# EasyEDA Pro project 16P1D_EDA.eprj

# Schematic ESP_MCB_SCH

## Sheets
1 ESP32: Board Name: ESP_MCB; Create Date: 2025-03-12; Page Name: ESP32; Project Name: 16P1D_EDA; Schematic Name: ESP_MCB_SCH; Update Date: 2025-03-13; Company: 嘉立创EDA; Page Size: A4; Version: V1.0
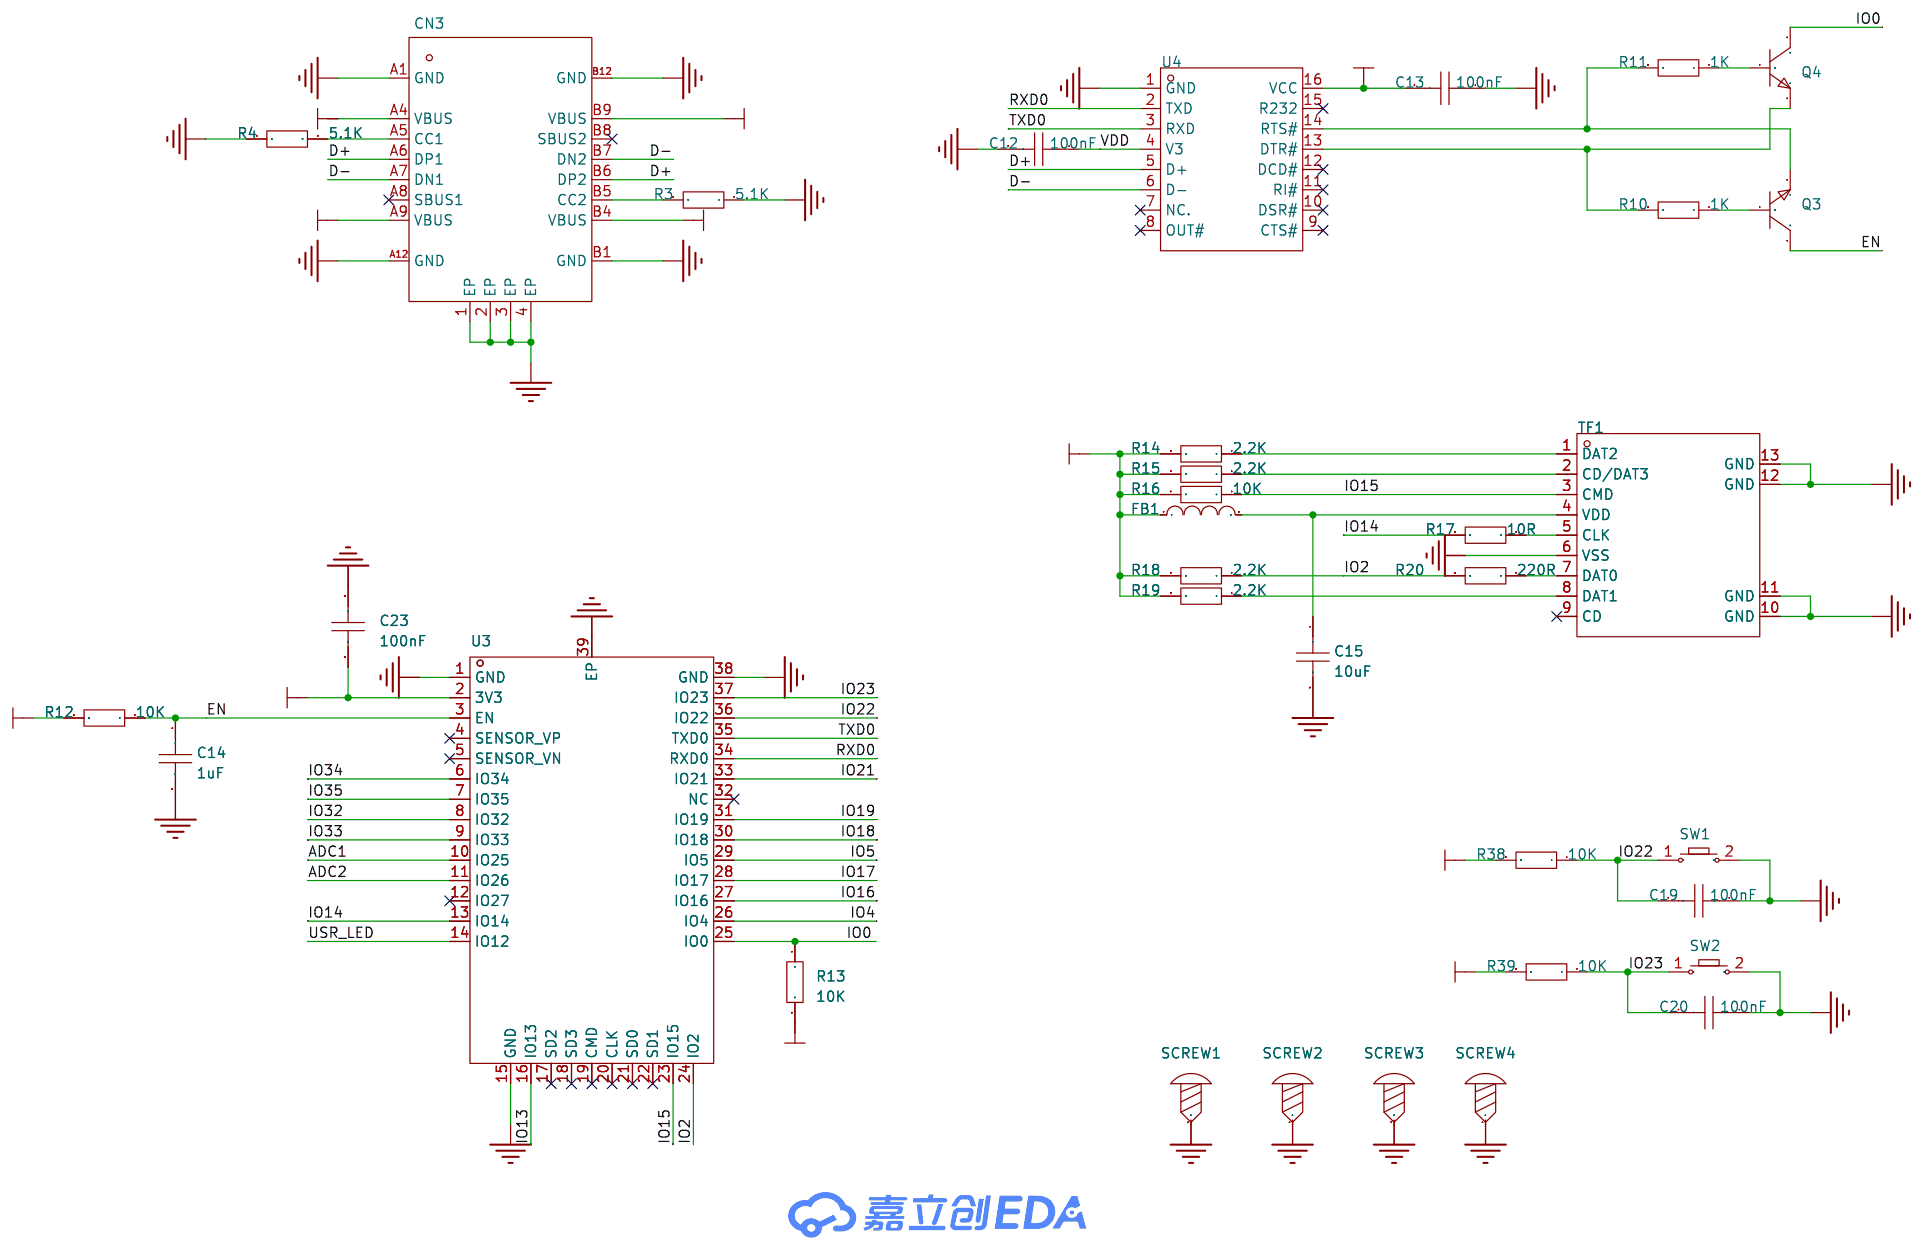
[diagram p0: ESP32]
2 DC: Page Name: DC
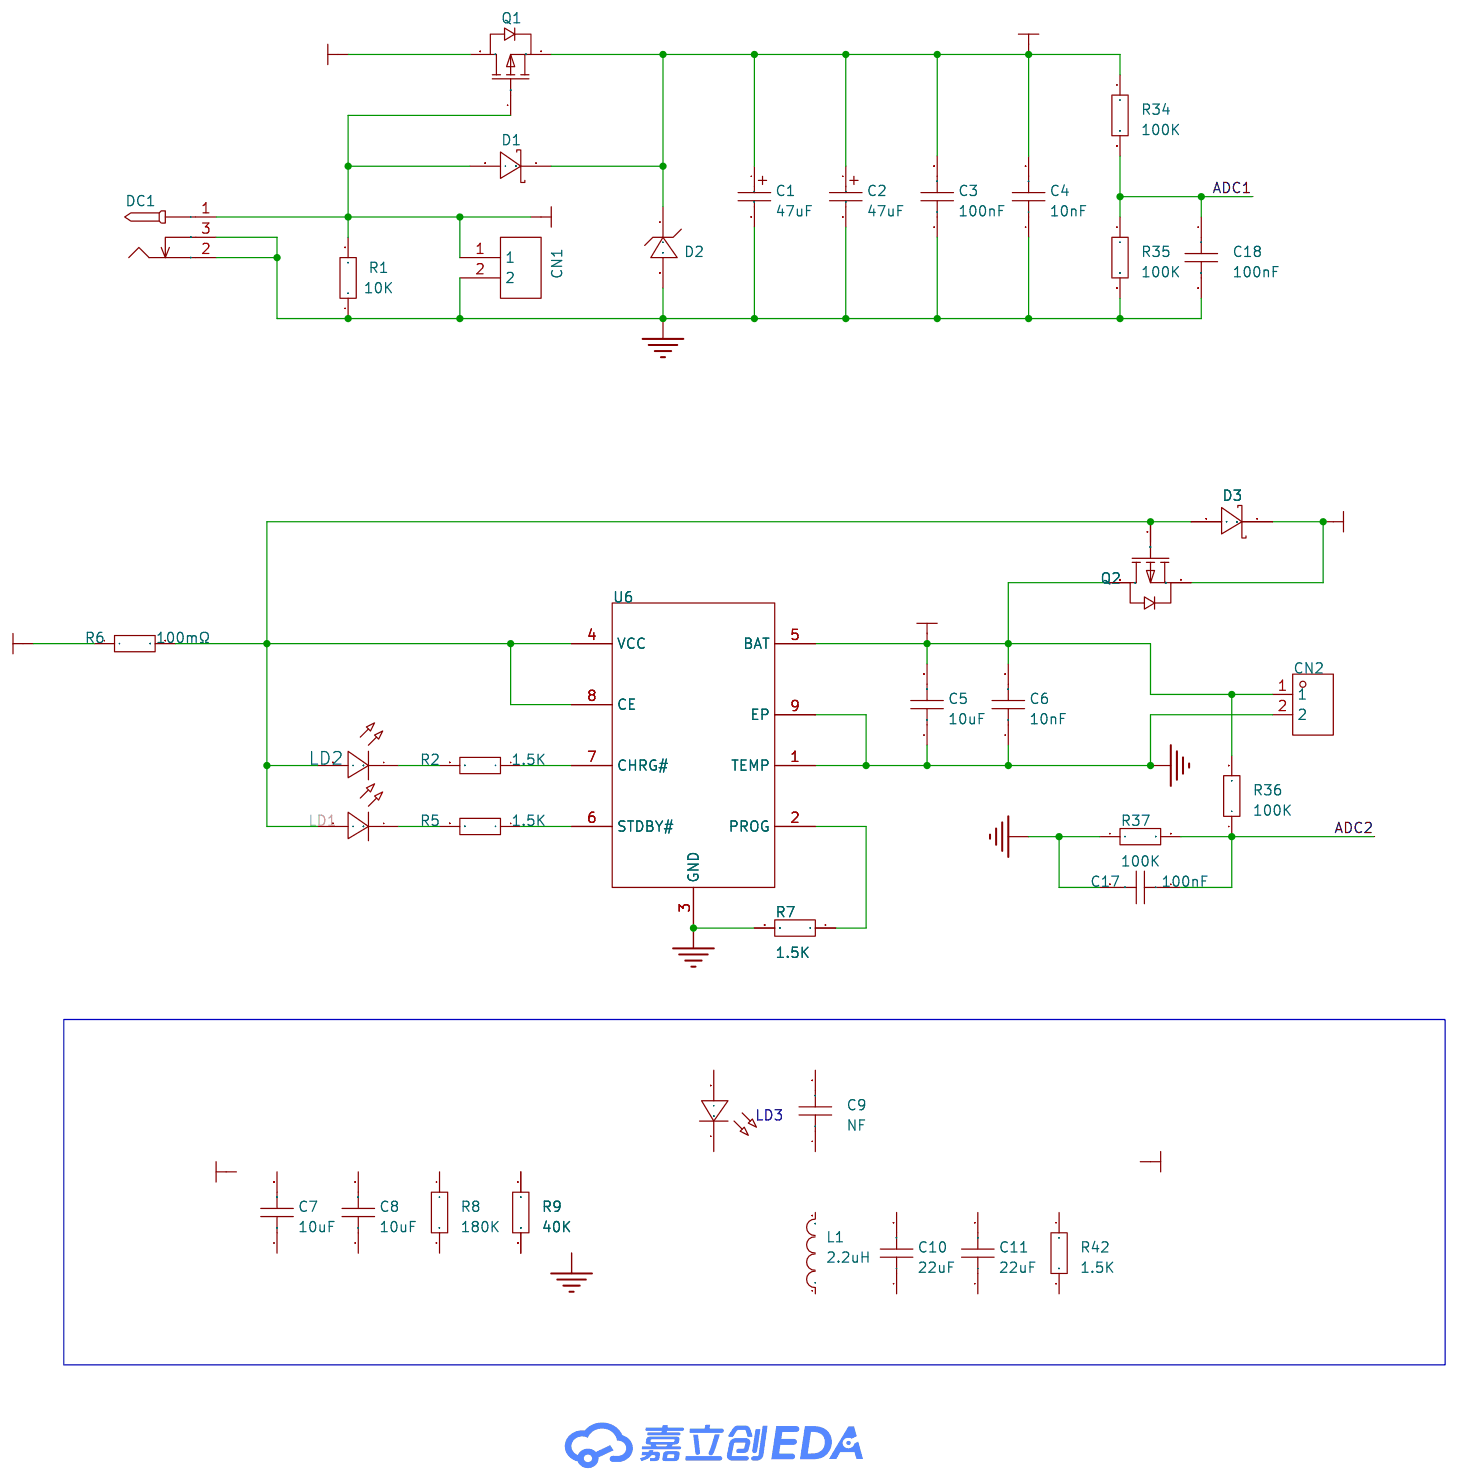
[diagram p1: DC]
3 RELAY: Page Name: RELAY
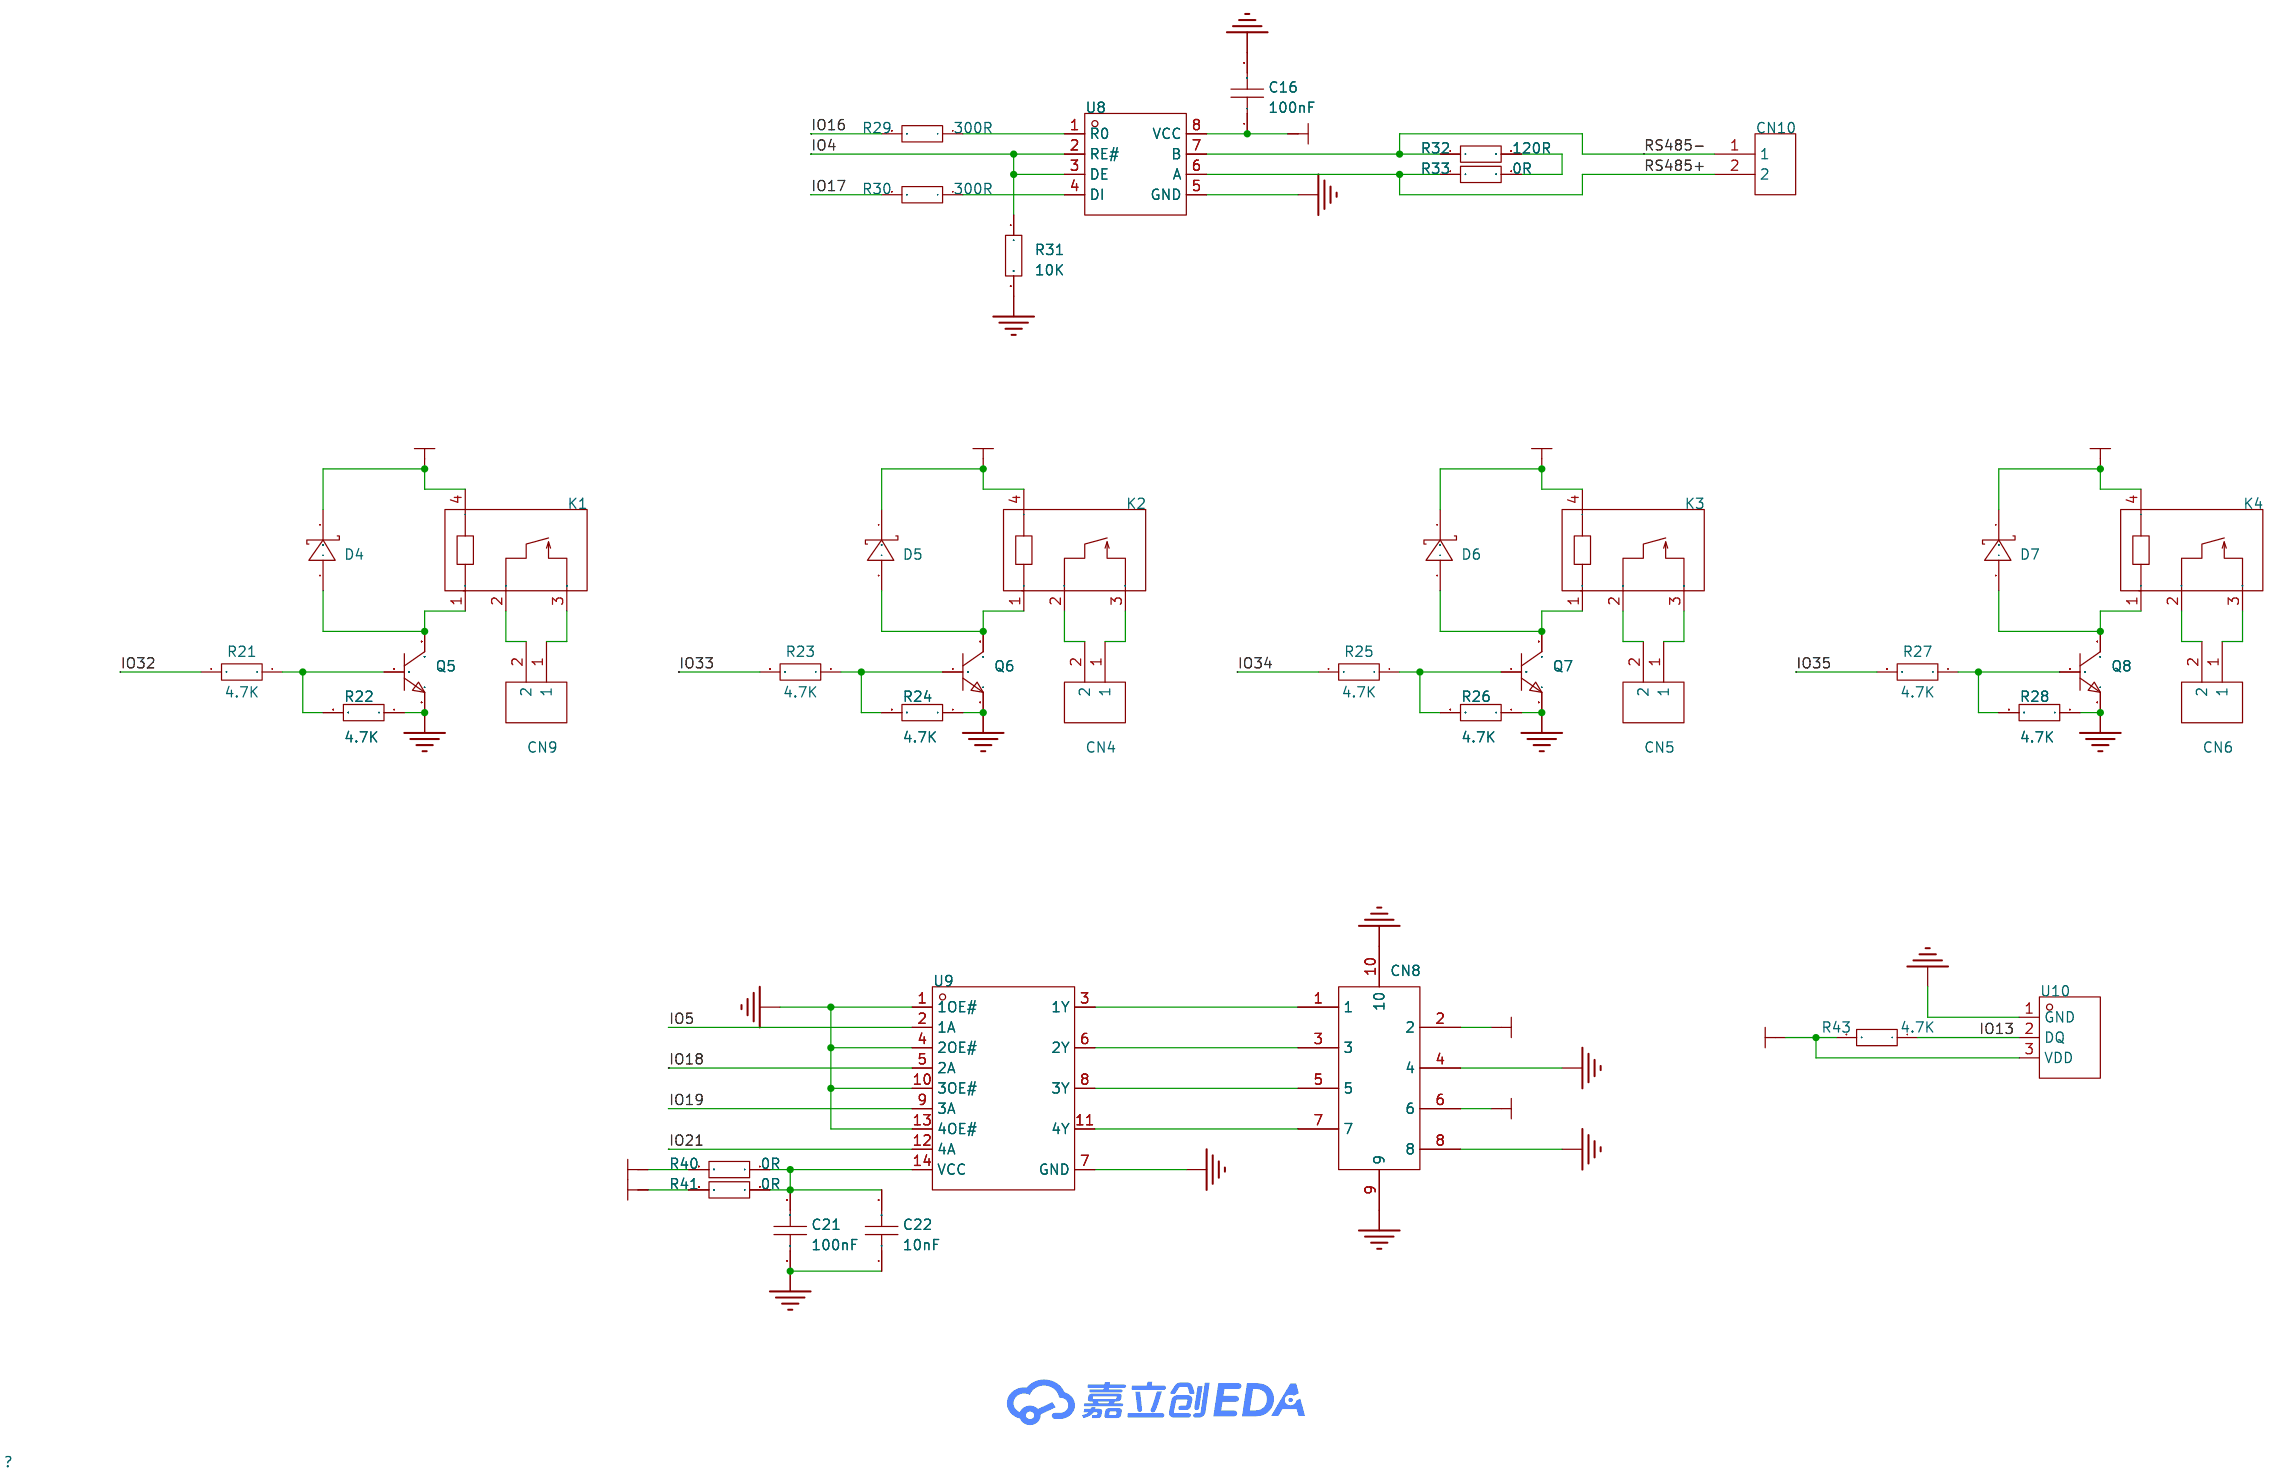
[diagram p2: RELAY]

## Parts
sheet DC
C1  47uF  [C_Ele_SMD_5x5.4mm]
C2  47uF  [C_Ele_SMD_5x5.4mm]
C3  100nF  [C0805]
C4  10nF  [C0805]
C5  10uF  [C0805]
C6  10nF  [C0805]
C7  10uF  [C0805]
C8  10uF  [C0805]
C9  NF  [C0805]
C10  22uF  [C0805]
C11  22uF  [C0805]
C17  100nF  [C0805]
C18  100nF  [C0805]
CN1  WJ500V-5.08-2P  [CONN-TH_2P-P5.00_WJ500V-5.08-2P]
CN2  ZX-XH2.54-2PZZ  [CONN-TH_2P-P2.50_HX25003-2A]
D1  SS34  [SMC_L6.9-W5.9-LS7.9-RD]
D2  SMBJ6.0A  [SMB_L4.6-W3.6-LS5.3-RD]
D3  SS34  [SMC_L6.9-W5.9-LS7.9-RD]
DC1  -  [DC-005_2.5]
L1  2.2uH  [IND-SMD_L4.4-W4.2]
LD1  -  [LED_0805]
LD2  -  [LED_0805]
LD3  -  [LED_0805]
Q1  AO3401A  [SOT-23_L2.9-W1.3-P1.90-LS2.4-BR]
Q2  AO3401A  [SOT-23_L2.9-W1.3-P1.90-LS2.4-BR]
R1  10K  [R0805]
R2  1.5K  [R0805]
R5  1.5K  [R0805]
R6  100mΩ  [R1210]
R7  1.5K  [R0805]
R8  180K  [R0805]
R9  40K  [R0805]
R34  100K  [R0805]
R35  100K  [R0805]
R36  100K  [R0805]
R37  100K  [R0805]
R42  1.5K  [R0805]
U6  TP4056-42-ESOP8  [ESOP-8_L4.9-W3.9-P1.27-LS6.0-BL-EP]
sheet ESP32
C12  100nF  [C0805]
C13  100nF  [C0805]
C14  1uF  [C0805]
C15  10uF  [C0805]
C19  100nF  [C0805]
C20  100nF  [C0805]
C23  100nF  [C0805]
CN3  -  [USB_TYPE-C-16P]
FB1  10uH  [L0805]
Q3  SS8050  [SOT-23-3_L2.9-W1.3-P1.90-LS2.4-BR]
Q4  SS8050  [SOT-23-3_L2.9-W1.3-P1.90-LS2.4-BR]
R3  5.1K  [R0805]
R4  5.1K  [R0805]
R10  1K  [R0805]
R11  1K  [R0805]
R12  10K  [R0805]
R13  10K  [R0805]
R14  2.2K  [R0805]
R15  2.2K  [R0805]
R16  10K  [R0805]
R17  10R  [R0805]
R18  2.2K  [R0805]
R19  2.2K  [R0805]
R20  220R  [R0805]
R38  10K  [R0805]
R39  10K  [R0805]
SCREW1  -  [M2螺丝]
SCREW2  -  [M2螺丝]
SCREW3  -  [M2螺丝]
SCREW4  -  [M2螺丝]
SW1  -  [Key_SMD_3x4x2]
SW2  -  [Key_SMD_3x4x2]
TF1  TF-CARD H1.8  [TF-SMD_TF-CARD-H1.8]
U3  ESP32-WROOM-32  [WIFIM-SMD_ESP-WROOM-32]
U4  CH340C  [SOP-16_L10.0-W3.9-P1.27-LS6.0-BL]
sheet RELAY
C16  100nF  [C0805]
C21  100nF  [C0805]
C22  10nF  [C0805]
CN4  WJ500V-5.08-2P  [CONN-TH_2P-P5.00_WJ500V-5.08-2P]
CN5  WJ500V-5.08-2P  [CONN-TH_2P-P5.00_WJ500V-5.08-2P]
CN6  WJ500V-5.08-2P  [CONN-TH_2P-P5.00_WJ500V-5.08-2P]
CN8  8P-立贴带锁  [FPC-SMD_8P-P0.50_AFC11-S08ICC-00]
CN9  WJ500V-5.08-2P  [CONN-TH_2P-P5.00_WJ500V-5.08-2P]
CN10  WJ500V-5.08-2P  [CONN-TH_2P-P5.00_WJ500V-5.08-2P]
D4  SS34  [SMC_L6.9-W5.9-LS7.9-RD]
D5  SS34  [SMC_L6.9-W5.9-LS7.9-RD]
D6  SS34  [SMC_L6.9-W5.9-LS7.9-RD]
D7  SS34  [SMC_L6.9-W5.9-LS7.9-RD]
K1  G5NB-1A-E-12VDC  [RELAY-TH_G5NB-1A-E-DCXX]
K2  G5NB-1A-E-12VDC  [RELAY-TH_G5NB-1A-E-DCXX]
K3  G5NB-1A-E-12VDC  [RELAY-TH_G5NB-1A-E-DCXX]
K4  G5NB-1A-E-12VDC  [RELAY-TH_G5NB-1A-E-DCXX]
Q5  SS8050  [SOT-23-3_L2.9-W1.3-P1.90-LS2.4-BR]
Q6  SS8050  [SOT-23-3_L2.9-W1.3-P1.90-LS2.4-BR]
Q7  SS8050  [SOT-23-3_L2.9-W1.3-P1.90-LS2.4-BR]
Q8  SS8050  [SOT-23-3_L2.9-W1.3-P1.90-LS2.4-BR]
R21  4.7K  [R0805]
R22  4.7K  [R0805]
R23  4.7K  [R0805]
R24  4.7K  [R0805]
R25  4.7K  [R0805]
R26  4.7K  [R0805]
R27  4.7K  [R0805]
R28  4.7K  [R0805]
R29  300R  [R0805]
R30  300R  [R0805]
R31  10K  [R0805]
R32  120R  [R0805]
R33  0R  [R0805]
R40  0R  [R0805]
R41  0R  [R0805]
R43  4.7K  [R0805]
U8  MAX485EIM/TR  [SOP-8_L4.9-W3.9-P1.27-LS6.0-BL]
U9  74HC125D/S400118  [SOIC-14_L8.6-W3.8-P1.27-LS6.0-BL]
U10  GX18B20  [TO-92-3_L4.9-W3.7-P1.27-L]

## Library data of the parts
C1 C2 = C_Ele_SMD_5x5.4mm: Supplier Footprint: SMD,5x5.4mm
C3-C23 = CAP_0805: Supplier Footprint: 0805
CN1 CN4-CN6 CN9 CN10 = WJ500V-5.08-2P: 结构:1x2P;间距:5.08mm;颜色:绿色;安装方式:直插;额定电流:18A;额定电压:250V;排数:1;线规 - AWG:14~30;线规 - 平方毫米:2.5;每排PIN数:2;触头材质:-;触头镀层:-;工作温度范围:-40℃~+105℃;焊接温度(最大值):-;; LCSC Part Name: 1x2P 5.08mm 直插 排数:1 每排P数:2; Supplier Part: C8465; Manufacturer: KANGNEX(康奈克斯电气); Supplier Footprint: 插件,P=5.08mm; JLCPCB Part Class: 扩展库; Datasheet: https://atta.szlcsc.com/upload/public/pdf/source/20191225/C8465_02D34CE5B5B4A53DF5891601D97FA9F4.pdf; Supplier: LCSC; Structure: 1x2P; Pitch: 5.08mm; Color: 绿色; Mounting Style: 直插; Current Rating (Max): 18A; Voltage Rating (Max): 250V; Number of Pins: 2P; Number of Rows: 1; Wire Gauge - AWG: 14~30; Wire Gauge - mm2: 2.5; Number of PINs Per Row: 2; Operating Temperature Range: -40℃~+105℃; Screw Specification: M2.5
CN2 = ZX-XH2.54-2PZZ: 插针结构:1x2P;间距:2.5mm;安装方式:直插;参考系列:XH;总PIN数:2P;排数:1;每排PIN数:2;行距:-;额定电流:3A;触头材质:黄铜;触头镀层:锡;工作温度范围:-25℃~+85℃;; LCSC Part Name: 1x2P 间距:2.5mm 直插 系列:XH; Supplier Part: C7429632; Manufacturer: Megastar(兆星); Supplier Footprint: 插件,P=2.5mm; JLCPCB Part Class: 扩展库; Datasheet: https://atta.szlcsc.com/upload/public/pdf/source/20230619/19BA6947230AA44A04D3EDD65E618FD0.pdf; Supplier: LCSC; Pins Structure: 1x2P; Pitch: 2.5mm; Mounting Type: 直插; Reference Series: XH; Number of Pins: 2P; Number of Rows: 1; Number of PINs Per Row: 2; Rated Current: 3A; Contact Material: 黄铜; Contact Plating: 锡; Operating Temperature: -25℃~+85℃; Rated Voltage (Max): 250V; Plastic Material: PA66; Flame Retardant Rating: UL94V-0; Color: 白色; Z-Height of the Board: 7mm; X-Length of Bottom Edge on Board (Spacing Line): 7.5mm; Y-Width of Bottom Edge on Board: 5.9mm
D1 D3-D7 = SS34_C154551: 正向压降(Vf):500mV@3A;直流反向耐压(Vr):40V;整流电流:3A;; LCSC Part Name: 电压:40V 电流:3A; Supplier Part: C154551; Manufacturer: onsemi(安森美); Supplier Footprint: SMC(DO-214AB); JLCPCB Part Class: 扩展库; Datasheet: https://atta.szlcsc.com/upload/public/pdf/source/20230523/C977B907190B075B30FD168351032A84.pdf; Supplier: LCSC; Forward Voltage (Vf@If): 500mV@3A; Reverse Voltage (Vr): 40V; Rectified Current: 3A; Reverse Leakage Current (Ir): 500uA@40V
D2 = SMBJ6.0A_C2987966: 反向截止电压(Vrwm):6V;最大钳位电压:10.3V;峰值脉冲电流(Ipp)@10/1000us:58.3A;峰值脉冲功率(Ppp)@10/1000us:600W;击穿电压:6.67V;; Supplier Part: C2987966; Manufacturer: RUILON(瑞隆源); Supplier Footprint: SMB(DO-214AA); JLCPCB Part Class: 扩展库; Datasheet: https://atta.szlcsc.com/upload/public/pdf/source/20211010/C2833511_00578EBDCC8DA9F5F0AA6629F746BAEA.pdf; Supplier: LCSC; Reverse Stand-Off Voltage (Vrwm): 6V; Maximum Clamping Voltage: 10.3V; Peak Pulse Current (Ipp)@10/1000us: 58.3A; Peak Pulse Power Dissipation (Ppp)@10/1000us: 600W; Breakdown Voltage: 6.67V; Reverse Leakage Current (Ir): 800uA; Type: TVS
DC1 = DC-005_2.5: Supplier Footprint: 插件
L1 = FXL0420-2R2-M: 电感值:2.2uH;精度:±20%;额定电流:4.5A;饱和电流(Isat):5A;类型:一体成型电感;; LCSC Part Name: 2.2uH ±20% 5A; Supplier Part: C167206; Manufacturer: cjiang(长江微电); Supplier Footprint: SMD,4.2x4.4mm; JLCPCB Part Class: 扩展库; Datasheet: https://atta.szlcsc.com/upload/public/pdf/source/20240426/3189EA8206330E2108542F9E34E540E7.pdf; Supplier: LCSC; Tolerance: ±20%; Rated Current: 4.5A; Saturation Current (Isat): 5A; DC Resistance (DCR): 58mΩ; Type: 一体成型电感
LD1 = LED_0805-G: Supplier Footprint: 0805
LD2 = LED_0805-R: Supplier Footprint: 0805
LD3 = LED_0805-B: Supplier Footprint: 0805
Q1 Q2 = AO3401A_C15127: 类型:1个P沟道;漏源电压(Vdss):30V;连续漏极电流(Id):4A;导通电阻(RDS(on)@Vgs,Id):44mΩ@10V,4.3A;功率(Pd):1.4W;阈值电压(Vgs(th)@Id):1.3V@250uA;; LCSC Part Name: 1个P沟道 耐压:30V 电流:4A; Supplier Part: C15127; Manufacturer: AOS; Supplier Footprint: SOT-23; JLCPCB Part Class: 基础库; Datasheet: https://atta.szlcsc.com/upload/public/pdf/source/20160507/1462613609053.pdf; Supplier: LCSC; Type: 1个P沟道; Drain Source Voltage (Vdss): 30V; Continuous Drain Current (Id): 4A; Drain Source On Resistance (RDS(on)@Vgs,Id): 44mΩ@10V,4.3A; Power Dissipation (Pd): 1.4W; Gate Threshold Voltage (Vgs(th)@Id): 1.3V@250uA; Total Gate Charge (Qg@Vgs): 12.2nC@4.5V; Input Capacitance (Ciss@Vds): 1.2nF@15V; Operating Temperature: -55℃~+150℃@(Tj)
R1-R5 R7-R43 = Res_0805: Supplier Footprint: 0805
R6 = 1210W2F100LT5E: 电阻类型:厚膜电阻;阻值:100mΩ;精度:±1%;功率:500mW;最大工作电压:200V;温度系数:±800ppm/℃;; LCSC Part Name: 100mΩ ±1% 500mW 厚膜电阻; Supplier Part: C270892; Manufacturer: UNI-ROYAL(厚声); Supplier Footprint: 1210; JLCPCB Part Class: 扩展库; Datasheet: https://atta.szlcsc.com/upload/public/pdf/source/20200306/C422600_1E6D84923E4A46A82E41ADD87F860B5C.pdf; Supplier: LCSC; Type: 厚膜电阻; Tolerance: ±1%; Power(Watts): 500mW; Overload Voltage (Max): 200V; Temperature Coefficient: ±800ppm/℃; Operating Temperature Range: -55℃~+155℃
U6 = TP4056-42-ESOP8: 锂电池充电芯片 42代表电池满电电压4.2V。; Supplier Part: C16581; Manufacturer: TOPPOWER(南京拓微); Supplier Footprint: ESOP-8; JLCPCB Part Class: 扩展库; Datasheet: https://atta.szlcsc.com/upload/public/pdf/source/20190626/C16581_611BCF5D7CF554EAE465137A8F68DB3E.pdf; Supplier: LCSC
CN3 = USB_TYPE-C-16P: Supplier Footprint: SMD
FB1 = L_0805
Q3-Q8 = SS8050_C7420370: 晶体管类型:NPN;集电极电流(Ic):1.5A;集射极击穿电压(Vceo):25V;功率(Pd):300mW;直流电流增益(hFE@Ic,Vce):120@100mA,1.0V;; LCSC Part Name: 耐压:25V 电流:1.5A NPN H档 200-350; Supplier Part: C7420370; Manufacturer: 宏迦橙; Supplier Footprint: SOT-23; JLCPCB Part Class: 扩展库; Datasheet: https://atta.szlcsc.com/upload/public/pdf/source/20231222/9C4050A7669EB24B3ACD0418218817FD.pdf; Supplier: LCSC; Transistor Type: NPN; Collector Current (Ic): 1.5A; Collector-Emitter Breakdown Voltage (Vceo): 25V; Power Dissipation (Pd): 300mW; DC Current Gain (hFE@Ic,Vce): 120@100mA,1.0V; Transition Frequency (fT): 100MHz; Collector Cut-Off Current (Icbo): 100nA; Collector-Emitter Saturation Voltage (VCE(sat)@Ic,Ib): 500mV@800mA,80mA; Operating Temperature: -55℃~+150℃
SCREW1-SCREW4 = M2螺丝: Supplier Footprint: 插件
SW1 SW2 = Key_SMD_3x4x2: Supplier Footprint: SMD
TF1 = TF-CARD H1.8: 卡连接方式:自弹式;卡类型:MicroSD卡(TF卡);连接器类型:卡座;本体最大高度:1.8mm;工作温度范围:-40℃~+70℃;; LCSC Part Name: 自弹式 MicroSD卡(TF卡) 卡座; Supplier Part: C7529389; Manufacturer: SHOU HAN(首韩); Supplier Footprint: SMD; JLCPCB Part Class: 扩展库; Datasheet: https://atta.szlcsc.com/upload/public/pdf/source/20230818/611DB5E7B45C91025B0B37F957961A64.pdf; Supplier: LCSC; Card Connection Mode: 自弹式; Card Type: MicroSD卡(TF卡); Connector Type: 卡座; Maximum Body Height: 1.8mm; Operating Temperature Range: -40℃~+70℃
U3 = ESP32-WROOM-32: WiFi+双模蓝牙 双核CPU 网口 顶配MCU 低功耗蓝牙 ESP32系列ESP-WROOM-32模组/ESP-32S 4MB; Supplier Part: C95209; Manufacturer: ESPRESSIF(乐鑫); JLCPCB Part Class: 扩展库; Datasheet: https://atta.szlcsc.com/upload/public/pdf/source/20170925/C95209_1506321763821990573.pdf; Supplier: LCSC
U4 = CH340C: 应用功能:收发器;接口协议:USB 2.0;数据速率:2Mbps;; LCSC Part Name: CH340C USB转串口芯片 CH340; Supplier Part: C84681; Manufacturer: WCH(南京沁恒); Supplier Footprint: SOP-16; JLCPCB Part Class: 扩展库; Datasheet: https://atta.szlcsc.com/upload/public/pdf/source/20240619/63986D8440D4E5267A77ACD891CC4DE3.pdf; Supplier: LCSC; Applications Function: 收发器; Protocol: USB 2.0; Supply Voltage: 3.3V；5V; Data Rate: 2Mbps
CN8 = 8P-立贴带锁: Supplier Part: C9900019730; Supplier Footprint: FPC-SMD_8P-P0.50; JLCPCB Part Class: 扩展库; Supplier: LCSC
K1-K4 = G5NB-1A-E-12VDC: Supplier Part: C9900015445; Supplier Footprint: RELAY-TH; JLCPCB Part Class: 扩展库; Supplier: LCSC
U8 = MAX485EIM/TR: MAX485是一款用于RS-485和RS-422通信的低功耗收发器。IC包含一个驱动器和一个接收器，支持高达2.5Mbps的数据速率。; LCSC Part Name: 低功耗、限斜率RS-485/RS-422收发器; Supplier Part: C519080; Manufacturer: HGSEMI(华冠); Supplier Footprint: SOP-8; JLCPCB Part Class: 扩展库; Datasheet: https://atta.szlcsc.com/upload/public/pdf/source/20200603/C519080_72B67520E7E5436CB4A0FBE085BFDF15.pdf; Supplier: LCSC
U9 = 74HC125D/S400118: 电源电压:2V~6V;每个元件位数:1;灌电流(IOL):7.8mA;拉电流(IOH):7.8mA;; Supplier Part: C3756553; Manufacturer: Nexperia(安世); Supplier Footprint: SO-14; JLCPCB Part Class: 扩展库; Datasheet: https://atta.szlcsc.com/upload/public/pdf/source/20240116/E75C32AE9AD810C0A731227E1DE6BA82.pdf; Supplier: LCSC; output type: 三态; Supply Voltage: 2V~6V; Number of Bits per Element: 1; Sink Current: 7.8mA; Source Current: 7.8mA; Logic Family: 74HC; Operating Temperature: -40℃~+125℃
U10 = GX18B20: 传感器类型:-;输出类型:-;局部感温:-;远程感温:-;分辨率:-;; Supplier Part: C472471; Manufacturer: GXCAS(中科银河芯); Supplier Footprint: TO-92; JLCPCB Part Class: Extended Part; Datasheet: https://atta.szlcsc.com/upload/public/pdf/source/20191223/C472471_5F454D6116551F3002EC8C6787AA9F75.pdf; Supplier: LCSC

## Nets
GND: C1.2 C2.2 C3.1 C4.1 C5.1 C6.1 C12.2 C13.1 C14.2 C15.2 C16.2 C17.2 C18.2 C19.1 C20.1 C21.1 C22.1 C23.2 CN1.2 CN2.2 CN3.1(EP) CN3.2(EP) CN3.3(EP) CN3.4(EP) CN3.A1(GND) CN3.A12(GND) CN3.B1(GND) CN3.B12(GND) CN8.4 CN8.8 CN8.9 CN8.10 D2.2 DC1.2 DC1.3 Q5.2(E) Q6.2(E) Q7.2(E) Q8.2(E) R1.1 R3.1 R4.1 R7.2 R22.1 R24.1 R26.1 R28.1 R31.2 R35.2 R37.1 SCREW1.1 SCREW2.1 SCREW3.1 SCREW4.1 SW1.2 SW2.2 TF1.6(VSS) TF1.10(GND) TF1.11(GND) TF1.12(GND) TF1.13(GND) U3.1(GND) U3.15(GND) U3.38(GND) U3.39(EP) U4.1(GND) U6.1(TEMP) U6.3(GND) U6.9(EP) U8.5(GND) U9.1(1OE#) U9.4(2OE#) U9.7(GND) U9.10(3OE#) U9.13(4OE#) U10.1(GND)
VBAT: C5.2 C6.2 CN2.1 Q2.3(D) R36.2 U6.5(BAT)
VBUS: CN3.A4(VBUS) CN3.A9(VBUS) CN3.B4(VBUS) CN3.B9(VBUS) Q1.3(D)
VDD: C12.1 C13.2 C16.1 C23.1 CN8.6 FB1.1 R12.2 R13.2 R14.2 R15.2 R16.2 R18.2 R19.2 R38.2 R39.2 R41.2 R43.2 U3.2(3V3) U4.4(V3) U4.16(VCC) U8.8(VCC) U10.3(VDD)
ADC1: C18.1 R34.2 R35.1 U3.10(IO25)
ADC2: C17.1 R36.1 R37.2 U3.11(IO26)
D+: CN3.A6(DP1) CN3.B6(DP2) U4.5(D+)
D-: CN3.A7(DN1) CN3.B7(DN2) U4.6(D-)
EN: C14.1 Q3.3(C) R12.1 U3.3(EN)
IO0: Q4.3(C) R13.1 U3.25(IO0)
IO2: R18.1 R20.2 U3.24(IO2)
IO4: R31.1 U3.26(IO4) U8.2(RE#) U8.3(DE)
IO5: U3.29(IO5) U9.2(1A)
IO13: R43.1 U3.16(IO13) U10.2(DQ)
IO14: R17.2 U3.13(IO14)
IO15: R16.1 TF1.3(CMD) U3.23(IO15)
IO16: R29.2 U3.27(IO16)
IO17: R30.2 U3.28(IO17)
IO18: U3.30(IO18) U9.5(2A)
IO19: U3.31(IO19) U9.9(3A)
IO21: U3.33(IO21) U9.12(4A)
IO22: C19.2 R38.1 SW1.1 U3.36(IO22)
IO23: C20.2 R39.1 SW2.1 U3.37(IO23)
IO32: R21.2 U3.8(IO32)
IO33: R23.2 U3.9(IO33)
IO34: R25.2 U3.6(IO34)
IO35: R27.2 U3.7(IO35)
RS485+: CN10.2 R33.1 U8.6(A)
RS485-: CN10.1 R32.1 U8.7(B)
RXD0: U3.34(RXD0) U4.2(TXD)
TXD0: U3.35(TXD0) U4.3(RXD)
USR_LED: U3.14(IO12)
V_EXT: CN1.1 D1.2(A) DC1.1(4) Q1.1(G) R1.2
VDC: D3.1(C) Q2.2(S)
VEXT: C1.1 C2.1 C3.2 C4.2 CN8.2 D1.1(C) D2.1 D4.1(C) D5.1(C) D6.1(C) D7.1(C) K1.4 K2.4 K3.4 K4.4 Q1.2(S) R6.1 R34.1 R40.2
Net-(C15-1): C15.1 FB1.2 TF1.4(VDD)
Net-(C21-2): C21.2 C22.2 R40.1 R41.1 U9.14(VCC)
Net-(CN3-A5): CN3.A5(CC1) R4.2
Net-(CN3-B5): CN3.B5(CC2) R3.2
Net-(CN4-1): CN4.1 K2.3
Net-(CN4-2): CN4.2 K2.2
Net-(CN5-1): CN5.1 K3.3
Net-(CN5-2): CN5.2 K3.2
Net-(CN6-1): CN6.1 K4.3
Net-(CN6-2): CN6.2 K4.2
Net-(CN8-1): CN8.1 U9.3(1Y)
Net-(CN8-3): CN8.3 U9.6(2Y)
Net-(CN8-5): CN8.5 U9.8(3Y)
Net-(CN8-7): CN8.7 U9.11(4Y)
Net-(CN9-1): CN9.1 K1.3
Net-(CN9-2): CN9.2 K1.2
Net-(D3-2): D3.2(A) LD1.2(A) LD2.2(A) Q2.1(G) R6.2 U6.4(VCC) U6.8(CE)
Net-(D4-2): D4.2(A) K1.1 Q5.3(C)
Net-(D5-2): D5.2(A) K2.1 Q6.3(C)
Net-(D6-2): D6.2(A) K3.1 Q7.3(C)
Net-(D7-2): D7.2(A) K4.1 Q8.3(C)
Net-(LD1-1): LD1.1(C) R5.2
Net-(LD2-1): LD2.1(C) R2.2
Net-(Q3-1): Q3.1(B) R10.1
Net-(Q3-2): Q3.2(E) R11.2 U4.14(RTS#)
Net-(Q4-1): Q4.1(B) R11.1
Net-(Q4-2): Q4.2(E) R10.2 U4.13(DTR#)
Net-(Q5-1): Q5.1(B) R21.1 R22.2
Net-(Q6-1): Q6.1(B) R23.1 R24.2
Net-(Q7-1): Q7.1(B) R25.1 R26.2
Net-(Q8-1): Q8.1(B) R27.1 R28.2
Net-(R2-1): R2.1 U6.7(CHRG#)
Net-(R5-1): R5.1 U6.6(STDBY#)
Net-(R7-1): R7.1 U6.2(PROG)
Net-(R14-1): R14.1 TF1.1(DAT2)
Net-(R15-1): R15.1 TF1.2(CD/DAT3)
Net-(R17-1): R17.1 TF1.5(CLK)
Net-(R19-1): R19.1 TF1.8(DAT1)
Net-(R20-1): R20.1 TF1.7(DAT0)
Net-(R29-1): R29.1 U8.1(R0)
Net-(R30-1): R30.1 U8.4(DI)
Net-(R32-2): R32.2 R33.2

Not connected (* = marked no-connect by the designer): C7 1 2; C8 1 2; C9 1 2; C10 1 2; C11 1 2; CN3 A8(SBUS1)* B8(SBUS2)*; L1 1 2; LD3 1(C) 2(A); R8 1 2; R9 1 2; R42 1 2; TF1 9(CD)*; U3 4(SENSOR_VP)* 5(SENSOR_VN)* 12(IO27)* 17(SD2)* 18(SD3)* 19(CMD)* 20(CLK)* 21(SD0)* 22(SD1)* 32(NC)*; U4 7(NC.)* 8(OUT#)* 9(CTS#)* 10(DSR#)* 11(RI#)* 12(DCD#)* 15(R232)*
